# Altium schematic sheet PWR_DIST.SchDoc
size Letter; DocumentNumber: 5; SheetNumber: 5; SheetTotal: 7
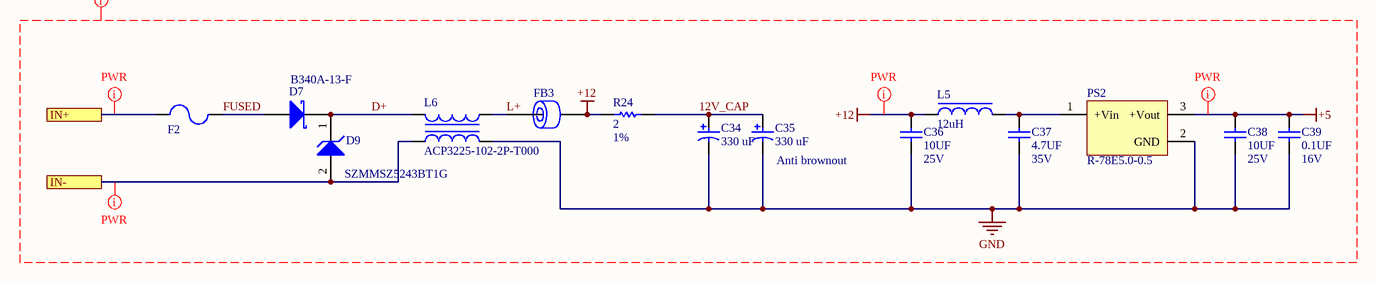
[diagram p0: PWR_DIST.SchDoc]

## Parts
C34  Rated Capacitance: 330 uF  [NIC-CAPA2-10X10_V]  (hidden comment: UUD1V331MNL1GS)
C35  Rated Capacitance: 330 uF  [NIC-CAPA2-10X10_V]  (hidden comment: UUD1V331MNL1GS)
C36  Val: 10UF  Vol: 25V  [0603_CAP]  (hidden comment: CAP 0603 10UF 25V 20% X5R)
C37  Val: 4.7UF  Vol: 35V  [0603_CAP]  (hidden comment: CAP 0603 4.7UF 35V 10% X5R)
C38  Val: 10UF  Vol: 25V  [0603_CAP]  (hidden comment: CAP 0603 10UF 25V 20% X5R)
C39  Val: 0.1UF  Vol: 16V  [0603_CAP]  (hidden comment: CAP 0603 0.1UF 16V 10% X7R)
D7  B340A-13-F  [DIOD-SMA-2_V]
D9  SZMMSZ5243BT1G  [ONSC-SOD-123-2-425-04_V]
F2  500 mA PTC  [1812RF]  (value not drawn)
FB3  Ferrite Chip 1500 Ohms  [0805]  (value not drawn)
L5  Inductance: 12uH  [IND_1225AS-H-120M=P2]  (hidden comment: 1225AS-H-120M=P2)
L6  ACP3225-102-2P-T000  [TDK-ACP3225-102-2P-T000-4_V]
PS2  R-78E5.0-0.5  [RECOM_R-78E5.0-0.5_0]
R24  Val: 2  Tol: 1%  [0805_RES]  (hidden comment: RES 0805 2 1%)

## Ports
IN+, IN-

## Nets
+5: C38.2 C39.2 PS2.3(+Vout)
+12: C36.2 FB3.2 L5.1 R24.1
GND: C34.2 C35.2 C36.1 C37.1 C38.1 C39.1 L6.3 PS2.2(GND)
12V_CAP: C34.1 C35.1 R24.2
D+: D7.2(K) D9.1(K) L6.1
FUSED: D7.1(A) F2.2
IN+: F2.1 ; port IN+
IN-: D9.2(A) L6.2 ; port IN-
L+: FB3.1 L6.4
NetC37_2: C37.2 L5.2 PS2.1(+Vin)

## Layout directives
net class PWR; net class PWR_RAIL: +5, +12, IN+, IN-
net class PWR: 12V_CAP, +5, +12, D+, FUSED, GND, L+

## Notes on the sheet
- (near C35) Anti brownout
- Title:
- Size:
- Date:
- Desc:
- Letter
- Auth:
- Sheet
- Proj:
- *
- of
- www.uvmaero.org
- File:

## Library data of the parts
C34 C35 = UUD1V331MNL1GS: Aluminum Electrolytic Capacitor, UD Series, Low Impedance, 330 uF, 35 V, + / - 20%, -55 to 105 degC, Chip Type, 10 x 10 mm D x L, Pb-Free, Reel; Manufacturer: Nichicon; Tolerance Rated Capacitance: -20 to 20%; Packing: Dia382mm Reel; Rated Voltage: 35 V; Rated Ripple Current (at 100kHz): 670 mA; Impedance: 0.09 Ohm; Endurance Time: 5000 h; Mounting Technology: Surface Mount; ComponentLink1Description: Manufacturer URL; PackageReference: CAPAE-D10H10; PartNumber: UUD1V331MNL1GS; ComponentLink2Description: Datasheet; Diameter: 10 mm; PackageDescription: 2-Pin Surface Mount Device, Diameter 10 mm, Height 10 mm, Pitch 8 mm; ComponentLink2URL: http://products.nichicon.co.jp/en/pdf/XJA043/e-ud.pdf; Length: 10 mm; ComponentLink3URL: http://products.nichicon.co.jp/en/pdf/XJA043/e-ud.pdf; DatasheetVersion: 08/2012; ComponentLink3Description: Package Specification; ComponentLink1URL: http://www.nichicon.co.jp/; RoHS: TRUE; Manufacturer 1: Nichicon; Manufacturer Part Number 1: UUD1V331MNL1GS; Supplier 1: Digi-Key; Supplier Part Number 1: 493-2293-1-ND
C36 C38 = CAP 0603 10UF 25V 20% X5R: Capacitor Surface Mount 0603 Footprint 10UF 25V 20% Tolerance Ceramic X5R; Manufacturer: Various; PCB Package: 0603; Description in Visual: Cap SMT 0603 10UF 25V 20% Ceramic X5R; P/N: CAP 0603 10UF 25V 20% X5R; Manufacturer P/N: Various; Value: 10UF; Voltage: 25V; Tolerance: 20%; Type: Ceramic X5R; ComponentLink1Description: Manufacturer Website; ComponentLink2Description: Component Datasheet; ComponentLink3Description: Octopart Link
C37 = CAP 0603 4.7UF 35V 10% X5R: Capacitor Surface Mount 0603 Footprint 47UF 35V 10% Tolerance Ceramic X5R; Manufacturer: Various; PCB Package: 0603; P/N: CAP 0603 4.7UF 35V 10% X5R; Manufacturer P/N: Various; Description in Visual: CAP 0603 4.7UF 35V 10% X5R; Value: 4.7UF; Voltage: 35V; Tolerance: 10%; Type: Ceramic X5R; ComponentLink1Description: Manufacturer Website; ComponentLink2Description: Component Datasheet; ComponentLink3Description: Octopart Link
C39 = CAP 0603 0.1UF 16V 10% X7R: Capacitor Surface Mount 0603 Footprint 0.1UF 16V 10% Tolerance Ceramic X7R; Manufacturer: Various; PCB Package: 0603; Description in Visual: Cap SMT 0603 0.1UF 16V 10%  Cer X7R; P/N: CAP 0603 0.1UF 16V 10% X7R; Manufacturer P/N: Various; Value: 0.1UF; Voltage: 16V; Tolerance: 10%; Type: Ceramic X7R; ComponentLink1Description: Manufacturer Website; ComponentLink2Description: Component Datasheet; ComponentLink3Description: Octopart Link
D7 = CMP-1667-00003-1: Surface Mount Schottky Barrier Rectifier, 40 V, 3 A, -55 to 150 degC, 2-Pin SMA, RoHS, Tape and Reel; Forward Current: 3 A; Forward Voltage: 500 mV; Max Surge Current: 80 A; Peak Reverse Current: 500 uA; Elements: 1; Mounting Technology: Surface Mount; ComponentLink1URL: http://www.diodes.com/; PackageDescription: 2-Pin Surface Mounted Assembly, Body 4.3 x 2.605 mm, Height 2.4 mm; Min Operating Temperature: -55 degC; Mount: Surface Mount; Pins: 2; ComponentLink2URL: http://www.diodes.com/_files/datasheets/ds30891.pdf; PackageReference: SMA-2; Max Operating Temperature: 125 degC; Radiation Hardening: No; Length: 4.6 mm; RoHSCompliant: true; ComponentLink1Description: Manufacturer URL; Height: 2.1 mm; ComponentLink2Description: Datasheet; Packaging: Tape and Reel; Package Quantity: 5000; Case\Package: SMA; DatasheetVersion: Rev. 17 - 2, 09/2015; REACH SVHC: No SVHC; Width: 2.92 mm
D9 = CMP-1060-00481-1: Zener Voltage Regulator, 500 mW, 2-Pin SOD-123, Pb-Free, Tape and Reel; Manufacturer: On Semiconductor; VZ Typ (V): 13; P Max (W): 0.5; DatasheetVersion: Rev. 12; RoHS: Pb-Free; PartNumber: SZMMSZ5243BT1G; ComponentLink3Description: Package Specification; ComponentLink1URL: http://www.onsemi.com/; PackageReference: SOD-123-2-425-04; ComponentLink2Description: Datasheet; PackageVersion: Rev. G, 10/2009; Packing: Tape and Reel; Mounting Technology: Surface Mount; ComponentLink1Description: Manufacturer URL; PackageDescription: 2-Pin SOD, Body 1.6 x 2.69 mm; ComponentLink2URL: http://www.onsemi.cn/pub_link/Collateral/MMSZ5221BT1-D.PDF; ComponentLink3URL: http://www.onsemi.com/pub_link/Collateral/425-04.PDF
F2 = MF-MSMF050: 500 mA 15 VDC PTC resettable fuse 1812 footprint; Manufacturer: Bourns; Description in Visual: Fuse Resettable SMT 500mA 15VDC 1812; Hold Current (mA): 500; Trip Current (mA): 1000; Max Current (A): 100; Max Voltage (V): 15; Time to Trip (sec): 0.15; Resistance (max) (Ohms): 1; PCB Package: 1812; P/N: MF-MSMF050; Manufacturer P/N: MF-MSMF050; Resistance (min) (Ohms): 0.15; ComponentLink1Description: Manufacturer Website; ComponentLink1URL: http://www.bourns.com; ComponentLink2Description: Component Datasheet; ComponentLink3Description: Octopart Link; ComponentLink3URL: http://octopart.com/partsearch/#search/requestData&q=MF-MSMF050
FB3 = 742792097: Ferrite Chip 1000 mA 1500 Ohms Differential Mode - Single 0805 Footprint; Manufacturer: Wurth Electronics; Description in Visual: Ferrite SMT 1000mA 1500Ohm Dif Mode 0805; Usage: Power Supply; Current (mA): 1000; Frequency: 100 MHz; Impedance at Freq (ohms): 1500; DC Resistance (ohms): 0.3; P/N: 742792097; Manufacturer P/N: 742792097; Filter type: Differential Mode - Single; Operating Temperature Range: -55 to +125 °C; PCB Package: 0805; ComponentLink1Description: Manufacturer Website; ComponentLink1URL: http://www.we-online.com; ComponentLink2Description: Component Datasheet; ComponentLink2URL: http://www.we-online.com/eisos/pdf/742792097.pdf; ComponentLink3Description: Octopart Link; ComponentLink3URL: http://octopart.com/partsearch/#search/requestData&q=742792097
L5 = 1225AS-H-120M=P2: 1µH Shielded Wirewound Inductor 15A 4.6mOhm Nonstandard; Manufacturer: Murata; Core Material: Ferrite; Current Rating: 760mA; DC Resistance (DCR): 350mR; Saturation Current: 550mA; Test Frequency: 100kHz; Tolerance: 20%; Case/Package: Nonstandard; Category: Fixed Inductors; Composition: Wirewound; Height - Seated (Max): 0.047inch; Length: 0.126inch; Manufacturer Part Number: 1225AS-H-120M=P2; Max Operating Temperature: 85°C; Min Operating Temperature: -40°C; Mount: Surface Mount; Packaging: Cut Tape; Shielding: Shielded; Width: 0.118inch; Supplier 1: Digi-Key; Supplier Part Number 1: 490-14147-1-ND
L6 = ACP3225-102-2P-T000: Common Mode Filter, 1000 Ohm Impedance, 1.2 A, 60 V, -40 to 85 degC, 4-Pin SMD, RoHS, Tape and Reel; Manufacturer: TDK; Online Catalog: ACPSeries; Other Names: 445-8637-6; Current: 1.5A; Featured Product: ACP3225SeriesFilter; Number of Lines: 2; Filter Type: PowerLine; Impedance: 1kOhm; DC Resistance (DCR): 50mOhm; Manufacturer URL: http://www.tdk.com/; Package Description: 4-Pin Surface Mount Device, Body 3.2 x 2.5 mm, Pitch 1.15 mm; Datasheet Version: Rev. 8, 07/2011; Package / Case: 1210(3225Metric),4Lead; Packaging: Digi-Reel; Inductance: -; Height (Max): 0.079"(2.00mm); Operating Temperature: -40degC~85degC; Size / Dimension: 0.126"Lx0.098"W(3.20mmx2.50mm); Datasheet URL: https://datasheet.ciiva.com/30106/acp3225-series-30106482.pdf; Standard Package: 1; Series: ACP; Mounting Type: SurfaceMount; Package Reference: ACP3225-102-2P-T000-4; Family: CommonModeChokes; Category: Filters; Manufacturer 1: TDK; Manufacturer Part Number 1: ACP3225-102-2P-T000
PS2 = R-78E5.0-0.5: IC Linear Regulator Replacement DC DC Converter 1 Output 5V 500mA 7V - 28V Input; Manufacturer: RECOM; Efficiency: 82-92% typ.; Input Voltage Range: 7V ~ 28V; Library Path1: parts/IC_RECOM_R-78E5.0-0.5_eec.SchLib; Max# Capacitive Load: 220µF; Part Number: R-78E5.0-0.5; Datasheet Path: datasheets/IC_RECOM_R-78E5.0-0.5_eec.pdf; ComponentLink1Description: Upverter; ComponentLink1URL: https://upverter.com/upn/revision/5351fc0564b0b61a/; ComponentLink2Description: Datasheet; ComponentLink2URL: https://www.recom-power.com/pdf/Innoline/R-78Exx-0.5.pdf; Datasheet Path1: datasheets/IC_RECOM_R-78E5.0-0.5_eec.pdf; Digikey Description: IC Linear Regulator Replacement DC DC Converter 1 Output 5V 500mA 7V - 28V Input; Digikey Part Number: 945-1648-5-ND; Lead Free: yes; Library Ref1: R-78E5.0-0.5; Mouser Part Number: 919-R-78E5.0-0.5; Output Current: 500mA; Output Voltage: 5V; Package: SIP-3; Price: 2.52764935796; RoHS: TRUE; Supplier 1: Digi-Key; Supplier 2: Mouser; Supplier Part Number 1: 945-1648-5-ND; Supplier Part Number 2: 919-R-78E5.0-0.5; Temperature: -40°C to +85°C; Temperature Range High: +85°C; Temperature Range Low: -40°C; helpURL: https://upverter.com/upn/revision/5351fc0564b0b61a/
R24 = RES 0805 2 1%: Resistor Surface Mount, 2 Ohms, 0805 Footprint, 1% Tolerance 0.125W; Manufacturer: Various; PCB Package: 0805; Description in Visual: Res SMT 2 0805  1%  0.125W; Value: 2; P/N: RES 0805 2 1%; Manufacturer P/N: Various; Power_Rating: 0.125W; Tolerance: 1%